# Altium schematic sheet Sheet1.SchDoc
size A4; SheetNumber: 1; SheetTotal: 1
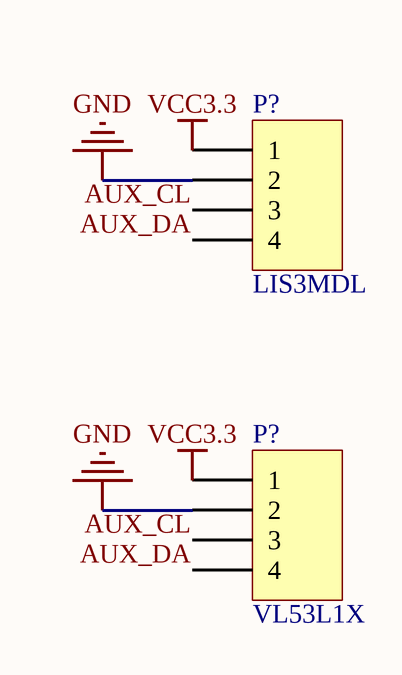
[diagram p0: Sheet1.SchDoc]

## Parts
(Parts that share a designator on the sheet are numbered #1, #2 ... from top to bottom, then left to right.)
P?#1  LIS3MDL  [HDR1X4]
P?#2  VL53L1X  [HDR1X4]

## Nets
GND: P?#1.2 P?#2.2
VCC3.3: P?#1.1 P?#2.1
AUX_CL: P?#1.3 P?#2.3
AUX_DA: P?#1.4 P?#2.4

## Library data of the parts
P?#1 P?#2 = Header 4: Header, 4-Pin; LatestRevisionDate: 17-Jul-2002; LatestRevisionNote: Re-released for DXP Platform.; Publisher: Altium Limited